# Altium schematic sheet CPU_CONTROL.SchDoc
size A2
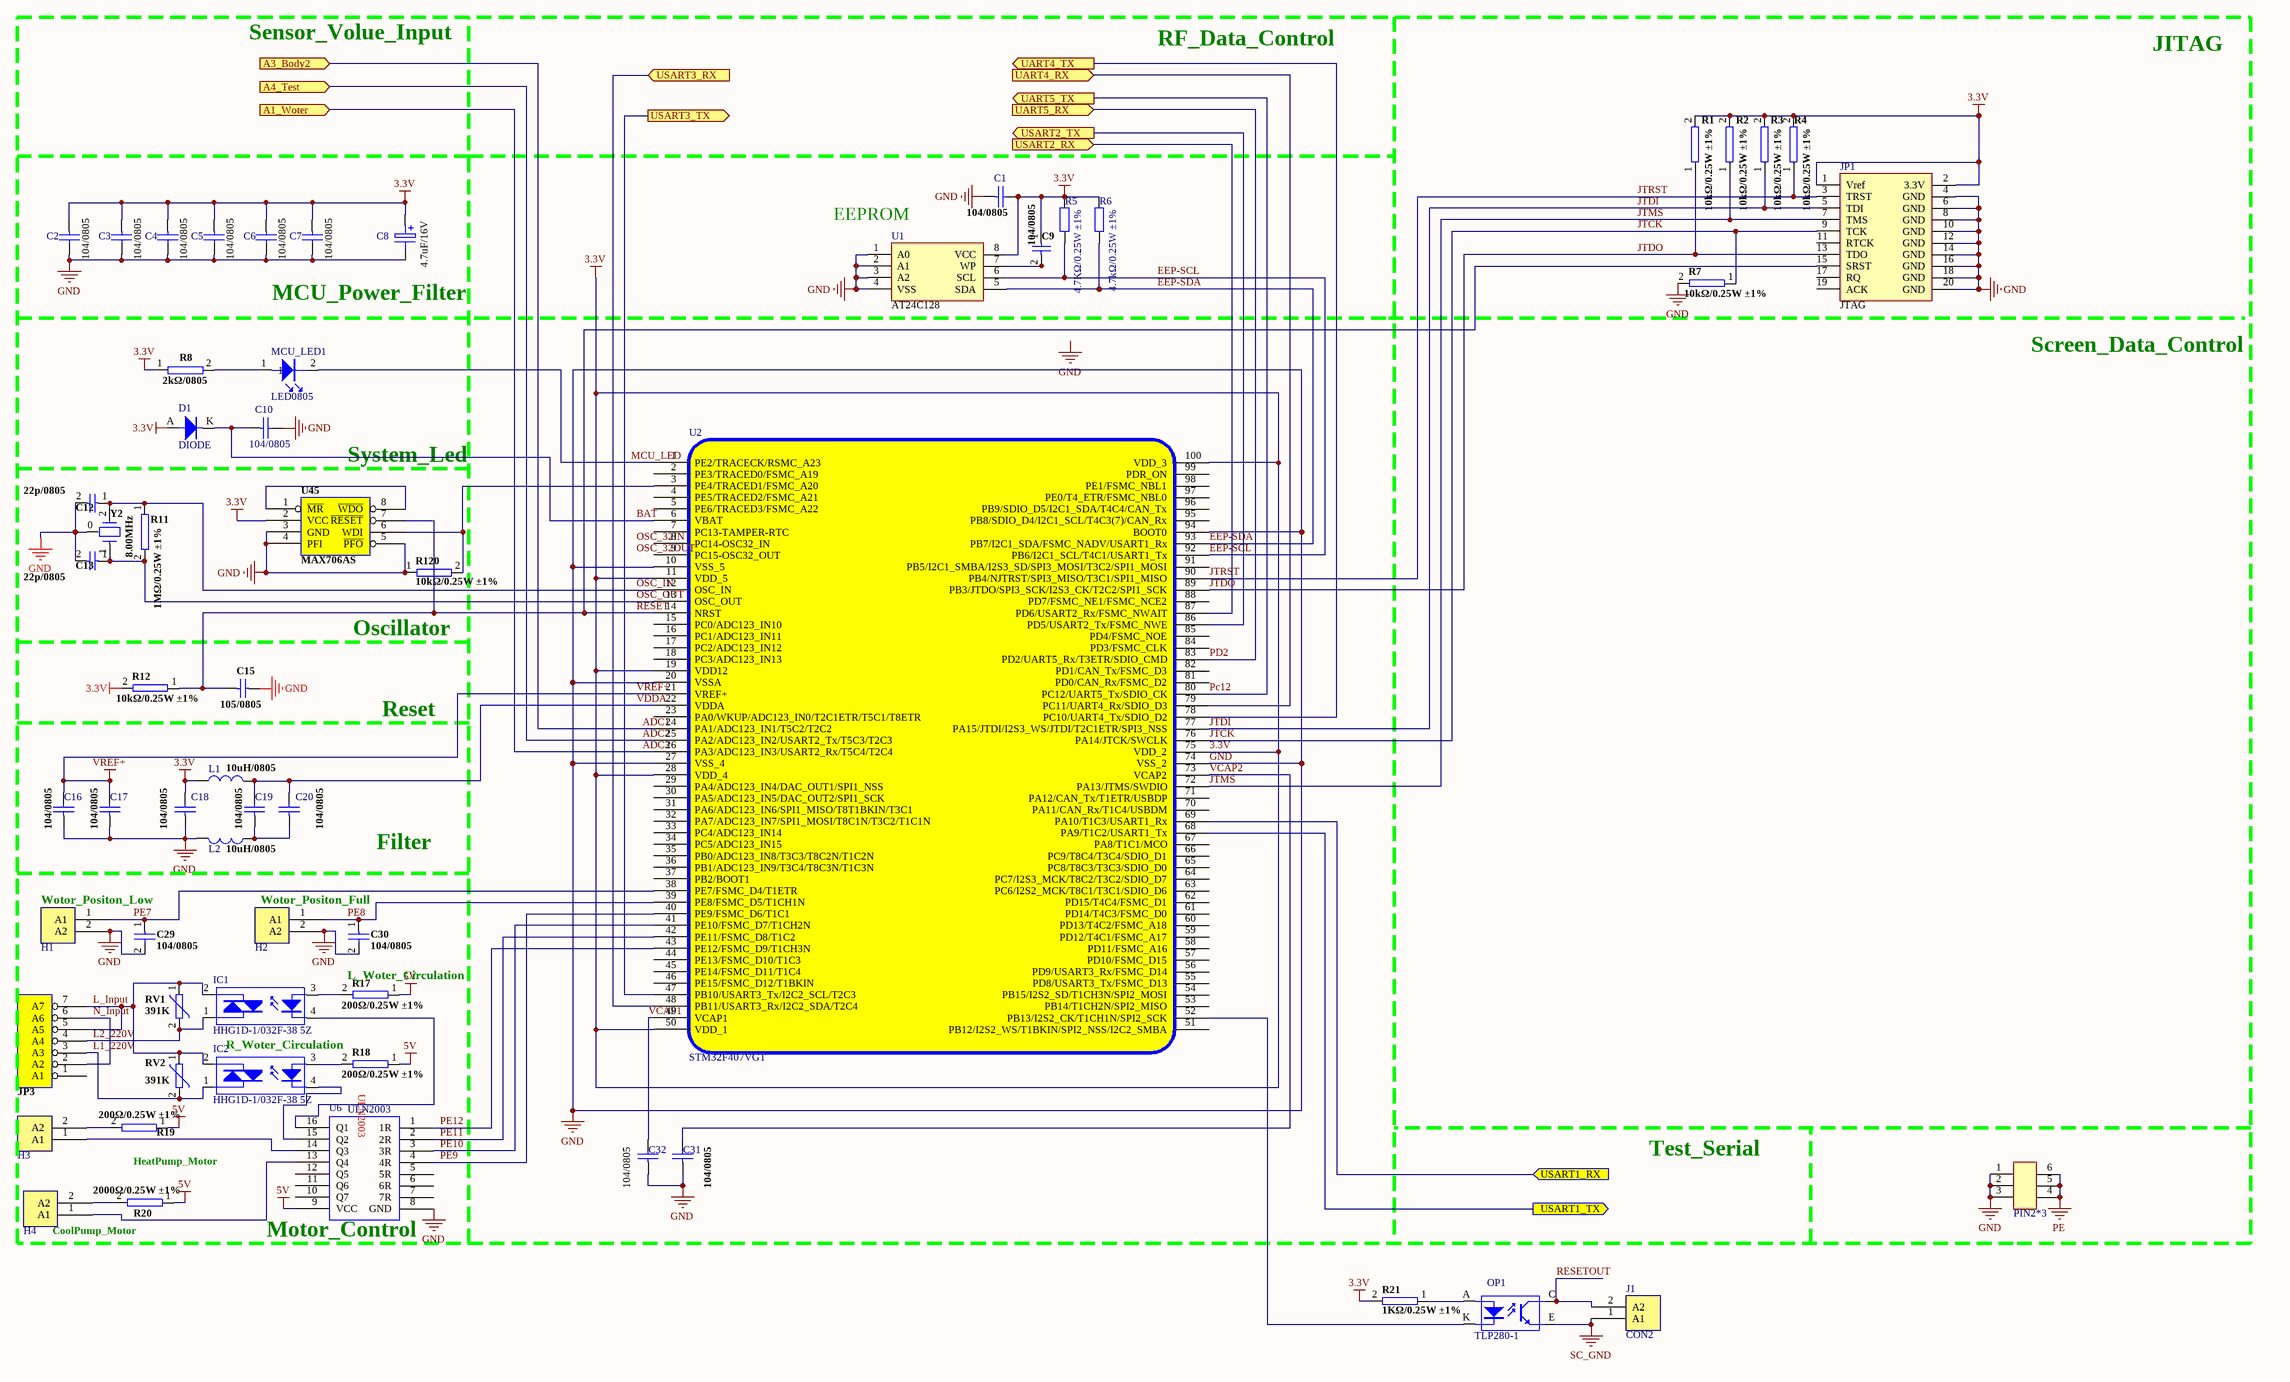
[diagram p0: CPU_CONTROL.SchDoc]

## Parts
C1  104/0805  [C0805]
C2  104/0805  [C0805]
C3  104/0805  [C0805]
C4  104/0805  [C0805]
C5  104/0805  [C0805]
C6  104/0805  [C0805]
C7  104/0805  [C0805]
C8  4.7uF/16V  [CAP5X5]
C9  104/0805  [C0805]
C10  104/0805  [C0805]
C12  22p/0805  [C0805]
C13  22p/0805  [C0805]
C15  105/0805  [C0805]
C16  104/0805  [C0805]
C17  104/0805  [C0805]
C18  104/0805  [C0805]
C19  104/0805  [C0805]
C20  104/0805  [C0805]
C29  104/0805  [C0805]
C30  104/0805  [C0805]
C31  104/0805  [C0805]
C32  104/0805  [C0805]
D1  DIODE  [SOD123]
H1  L_Wotor_Port  [XH2]  (value not drawn)
H2  F_Wotor_Port  [XH2]  (value not drawn)
H3  Heat_Port  [XH2]  (value not drawn)
H4  Cool_Port  [XH2]  (value not drawn)
IC1  HHG1D-1/032F-38 5Z  [HHG1-REALY]
IC2  HHG1D-1/032F-38 5Z  [HHG1-REALY]
J1  CON2  [2Pin-2.54]
JP1  JTAG  [IDC20_A]
JP3  L_N_Port  [HEADER1x7]  (value not drawn)
L1  10uH/0805  [L0805]
L2  10uH/0805  [L0805]
MCU_LED1  LED0805  [LED_0805]
OP1  TLP280-1  [SOP4]
PE1  PIN2*3  [IDC2x3]
R1  10kΩ/0.25W ±1%  [R0805]
R2  10kΩ/0.25W ±1%  [R0805]
R3  10kΩ/0.25W ±1%  [R0805]
R4  10kΩ/0.25W ±1%  [R0805]
R5  4.7KΩ/0.25W ±1%  [R0805]
R6  4.7kΩ/0.25W ±1%  [R0805]
R7  10kΩ/0.25W ±1%  [R0805]
R8  2kΩ/0805  [R0805]
R11  1MΩ/0.25W ±1%  [R0805]
R12  10kΩ/0.25W ±1%  [R0805]
R17  200Ω/0.25W ±1%  [R0805]
R18  200Ω/0.25W ±1%  [R0805]
R19  200Ω/0.25W ±1%  [R0805]
R20  2000Ω/0.25W ±1%  [R0805]
R21  1KΩ/0.25W ±1%  [R0805]
R120  10kΩ/0.25W ±1%  [R0805]
RV1  391K  [RV0.3]
RV2  391K  [RV0.3]
U1  AT24C128  [SO-8]
U2  STM32F407VGT  [LQFP-100]
U6  ULN2003  [SOIC-16]
U45  MAX706AS  [SO-8]
Y2  8.00MHz  [XTAL_SOCKET]

## Ports
A1_Woter (in), A3_Body2 (in), A4_Test (in), UART4_RX (in), UART4_TX (out), UART5_RX (in), UART5_TX (out), USART1_RX (in), USART1_TX (out), USART2_RX (in), USART2_TX (out), USART3_RX (in), USART3_TX (out)

## Nets
3.3V: C1.2 C2.1 C3.1 C4.1 C5.1 C6.1 C7.1 C8.1 C9.1 C18.2 D1.A JP1.1(Vref) JP1.2(3.3V) L1.1 R1.2 R2.2 R3.2 R4.2 R5.2 R6.2 R8.1 R12.2 R21.2 U1.8(VCC) U2.11(VDD_5) U2.19(VDD12) U2.28(VDD_4) U2.50(VDD_1) U2.75(VDD_2) U2.100(VDD_3) U45.2(VCC)
5V: R17.1 R18.1 R19.1 R20.1 U6.9(VCC)
GND: C1.1 C2.2 C3.2 C4.2 C5.2 C6.2 C7.2 C8.2 C10.2 C12.2 C13.2 C15.1 C16.1 C17.1 C18.1 C29.2 C30.2 C31.1 C32.1 H1.2(A2) H2.2(A2) JP1.4(GND) JP1.6(GND) JP1.8(GND) JP1.10(GND) JP1.12(GND) JP1.14(GND) JP1.16(GND) JP1.18(GND) JP1.20(GND) L2.1 PE1.1 PE1.2 PE1.3 R7.2 R120.1 U1.1(A0) U1.2(A1) U1.3(A2) U1.4(VSS) U2.10(VSS_5) U2.20(VSSA) U2.27(VSS_4) U2.74(VSS_2) U2.94(BOOT0) U6.8(GND) U45.3(GND) U45.4(PFI) U45.5(~{PFO}) Y2.0
PE: PE1.4 PE1.5 PE1.6
SC_GND: J1.1(A1) OP1.E
VREF+: C16.2 C17.2 U2.21(VREF+)
ADC1: U2.24(PA1/ADC123_IN1/T5C2/T2C2) ; port A3_Body2
ADC2: U2.25(PA2/ADC123_IN2/USART2_Tx/T5C3/T2C3) ; port A4_Test
ADC3: U2.26(PA3/ADC123_IN3/USART2_Rx/T5C4/T2C4) ; port A1_Woter
BAT: C10.1 D1.K U2.6(VBAT)
EEP-SCL: R5.1 U1.6(SCL) U2.92(PB6/I2C1_SCL/T4C1/USART1_Tx)
EEP-SDA: R6.1 U1.5(SDA) U2.93(PB7/I2C1_SDA/FSMC_NADV/USART1_Rx)
JTCK: JP1.9(TCK) R7.1 U2.76(PA14/JTCK/SWCLK)
JTDI: JP1.5(TDI) R3.1 U2.77(PA15/JTDI/I2S3_WS/JTDI/T2C1ETR/SPI3_NSS)
JTDO: JP1.13(TDO) R1.1 U2.89(PB3/JTDO/SPI3_SCK/I2S3_CK/T2C2/SPI1_SCK)
JTMS: JP1.7(TMS) R2.1 U2.72(PA13/JTMS/SWDIO)
JTRST: JP1.3(TRST) R4.1 U2.90(PB4/NJTRST/SPI3_MISO/T3C1/SPI1_MISO)
L1_220V: IC2.1 JP3.3(A3) RV2.2
L2_220V: IC1.1 JP3.4(A4) RV1.2
L_Input: IC1.2 IC2.2 JP3.5(A5) JP3.7(A7) RV1.1 RV2.1
MCU_LED: MCU_LED1.2 U2.1(PE2/TRACECK/RSMC_A23)
N_Input: JP3.2(A2) JP3.6(A6)
OSC_IN: C12.1 R11.1 U2.12(OSC_IN) Y2.2
OSC_OUT: C13.1 R11.2 U2.13(OSC_OUT) Y2.1
Pc12: U2.80(PC12/UART5_Tx/SDIO_CK) ; port UART5_TX
PD2: U2.83(PD2/UART5_Rx/T3ETR/SDIO_CMD) ; port UART5_RX
PE7: C29.1 H1.1(A1) U2.38(PE7/FSMC_D4/T1ETR)
PE8: C30.1 H2.1(A1) U2.39(PE8/FSMC_D5/T1CH1N)
PE9: U2.40(PE9/FSMC_D6/T1C1) U6.4(4R)
PE10: U2.41(PE10/FSMC_D7/T1CH2N) U6.3(3R)
PE11: U2.42(PE11/FSMC_D8/T1C2) U6.2(2R)
PE12: U2.43(PE12/FSMC_D9/T1CH3N) U6.1(1R)
RESET: C15.2 JP1.15(SRST) R12.1 U2.14(NRST) U45.7(~{RESET})
RESETOUT: J1.2(A2) OP1.C
UART4_RX: U2.79(PC11/UART4_Rx/SDIO_D3) ; port UART4_RX
UART4_TX: U2.78(PC10/UART4_Tx/SDIO_D2) ; port UART4_TX
USART1_RX: U2.69(PA10/T1C3/USART1_Rx) ; port USART1_RX
USART1_TX: U2.68(PA9/T1C2/USART1_Tx) ; port USART1_TX
USART2_RX: U2.87(PD6/USART2_Rx/FSMC_NWAIT) ; port USART2_RX
USART2_TX: U2.86(PD5/USART2_Tx/FSMC_NWE) ; port USART2_TX
USART3_RX: U2.48(PB11/USART3_Rx/I2C2_SDA/T2C4) ; port USART3_RX
USART3_TX: U2.47(PB10/USART3_Tx/I2C2_SCL/T2C3) ; port USART3_TX
VCAP1: C32.2 U2.49(VCAP1)
VCAP2: C31.2 U2.73(VCAP2)
VDDA: C19.2 C20.2 L1.2 U2.22(VDDA)
NetC9_2: C9.2 U1.7(WP)
NetC19_1: C19.1 C20.1 L2.2
NetH3_1: H3.1(A1) U6.14(Q3)
NetH3_2: H3.2(A2) R19.2
NetH4_1: H4.1(A1) U6.13(Q4)
NetH4_2: H4.2(A2) R20.2
NetIC1_3: IC1.3 R17.2
NetIC1_4: IC1.4 U6.16(Q1)
NetIC2_3: IC2.3 R18.2
NetIC2_4: IC2.4 U6.15(Q2)
NetMCU_LED1_1: MCU_LED1.1 R8.2
NetOP1_A: OP1.A R21.1
NetOP1_K: OP1.K U2.52(PB13/I2S2_CK/T1CH1N/SPI2_SCK)
NetR120_2: R120.2 U2.3(PE4/TRACED1/FSMC_A20) U45.6(WDI)
NetU45_1: U45.1(~{MR}) U45.8(~{WDO})

Not connected (* = marked no-connect by the designer): JP1 11(RTCK) 17(RQ) 19(ACK); JP3 1(A1); U2 2(PE3/TRACED0/FSMC_A19) 4(PE5/TRACED2/FSMC_A21) 5(PE6/TRACED3/FSMC_A22) 7(PC13-TAMPER-RTC) 8(PC14-OSC32_IN) 9(PC15-OSC32_OUT) 15(PC0/ADC123_IN10) 16(PC1/ADC123_IN11) 17(PC2/ADC123_IN12) 18(PC3/ADC123_IN13) 23(PA0/WKUP/ADC123_IN0/T2C1ETR/T5C1/T8ETR) 29(PA4/ADC123_IN4/DAC_OUT1/SPI1_NSS) 30(PA5/ADC123_IN5/DAC_OUT2/SPI1_SCK) 31(PA6/ADC123_IN6/SPI1_MISO/T8T1BKIN/T3C1) 32(PA7/ADC123_IN7/SPI1_MOSI/T8C1N/T3C2/T1C1N) 33(PC4/ADC123_IN14) 34(PC5/ADC123_IN15) 35(PB0/ADC123_IN8/T3C3/T8C2N/T1C2N) 36(PB1/ADC123_IN9/T3C4/T8C3N/T1C3N) 37(PB2/BOOT1) 44(PE13/FSMC_D10/T1C3) 45(PE14/FSMC_D11/T1C4) 46(PE15/FSMC_D12/T1BKIN) 51(PB12/I2S2_WS/T1BKIN/SPI2_NSS/I2C2_SMBA) 53(PB14/T1CH2N/SPI2_MISO) 54(PB15/I2S2_SD/T1CH3N/SPI2_MOSI) 55(PD8/USART3_Tx/FSMC_D13) 56(PD9/USART3_Rx/FSMC_D14) 57(PD10/FSMC_D15) 58(PD11/FSMC_A16) 59(PD12/T4C1/FSMC_A17) 60(PD13/T4C2/FSMC_A18) 61(PD14/T4C3/FSMC_D0) 62(PD15/T4C4/FSMC_D1) 63(PC6/I2S2_MCK/T8C1/T3C1/SDIO_D6) 64(PC7/I2S3_MCK/T8C2/T3C2/SDIO_D7) 65(PC8/T8C3/T3C3/SDIO_D0) 66(PC9/T8C4/T3C4/SDIO_D1) 67(PA8/T1C1/MCO) 70(PA11/CAN_Rx/T1C4/USBDM) 71(PA12/CAN_Tx/T1ETR/USBDP) 81(PD0/CAN_Rx/FSMC_D2) 82(PD1/CAN_Tx/FSMC_D3) 84(PD3/FSMC_CLK) 85(PD4/FSMC_NOE) 88(PD7/FSMC_NE1/FSMC_NCE2) 91(PB5/I2C1_SMBA/I2S3_SD/SPI3_MOSI/T3C2/SPI1_MOSI) 95(PB8/SDIO_D4/I2C1_SCL/T4C3(7)/CAN_Rx) 96(PB9/SDIO_D5/I2C1_SDA/T4C4/CAN_Tx) 97(PE0/T4_ETR/FSMC_NBL0) 98(PE1/FSMC_NBL1) 99(PDR_ON); U6 5(5R) 6(6R) 7(7R) 10(Q7) 11(Q6) 12(Q5)

## Notes on the sheet
- Sensor_Volue_Input
- RF_Data_Control
- JITAG
- (near U1) EEPROM
- MCU_Power_Filter
- Screen_Data_Control
- (near U45) System_Led
- (near R120) Oscillator
- Reset
- Filter
- (near H1) Wotor_Positon_Low
- (near H2) Wotor_Positon_Full
- L_Woter_Circulation
- R_Woter_Circulation
- HeatPump_Motor
- Test_Serial
- (near H4) CoolPump_Motor
- (near U6) Motor_Control
- Labels drawn without touching a wire or pin: GND, OSC_32IN, OSC_32OUT

## Library data of the parts
C1-C7 C16-C20 C29-C32 = CAP: 贴片电容 104/25V ±1% C0805
C8 = ELECTRO1: 贴片钽电容 4.7uF/16V ±10% CAP5X5
C9 = CAP: 贴片电容 104/25V ±1% C0805; Part Field 1: 08-500106-06
C10 = CAP: 贴片电容 104/50V ±1% C0805
C12 C13 = CAP: 贴片电容 22pF/25V ±1% C0805
C15 = CAP: 贴片电容 105/25V ±1% C0805; Value: 100pF; Published: 8-Jun-2000; Revision: July-2002: Re-released for DXP Platform.; Publisher: Altium Limited
D1 = DIODE: 高速开关二极管 IN4148 1V 150mA SOD123
H1-H4 = CON2: 插座式端子 XH2.54-2P 250V(DC/AC) 3A
IC1 IC2 = OPTOTRIAC: 固态继电器 HHG1D-1/032F-38 5Z HHG1-REALY
J1 = CON2: 单排排针（2针）2.54mm 2Pin-2.54
JP1 = JTAG20: 双排排针（10针）2.54mm IDC20_A
JP3 = CON7: 接线端子 22-12AWG 300V 20A 间距8.5mm/HEADER1x7
L1 L2 = INDUCTOR1: 贴片电感 10uH/L0805/0.25W ±10%
MCU_LED1 = LED0805: 贴片LED灯 2.0V 20mA 蓝色 LED_0805
OP1 = TLP521: 光耦 TLP280-1 SOP4
PE1 = PIN2*3: 双排排针（3针）2.54mm IDC2x3
R1-R4 R7 R12 R120 = RES2: 贴片电阻 10kΩ 0.25W ±1% R0805
R5 = Res2: 贴片电阻 4.7kΩ 0.25W ±1% R0805; Value: 4.7K/0805; Published: 8-Jun-2000; LatestRevisionDate: 17-Jul-2002; LatestRevisionNote: Re-released for DXP Platform.; PackageReference: AXIAL-0.4; Publisher: Altium Limited
R6 = Res2: 贴片电阻 4.7kΩ/0.25W ±1% R0805; Value: 4.7ΩK/0.25W; Published: 8-Jun-2000; LatestRevisionDate: 17-Jul-2002; LatestRevisionNote: Re-released for DXP Platform.; PackageReference: AXIAL-0.4; Publisher: Altium Limited
R8 = RES2: 贴片电阻 2kΩ 0.25W ±1% R0805; Part Field 1: 06-115611-18
R11 = RES2: 贴片电阻 1MΩ 0.25W ±1% R0805
R17-R19 = RES2: 贴片电阻 200Ω 0.25W ±1% R0805
R20 = RES2: 贴片电阻 2kΩ 0.25W ±1% R0805
R21 = RES2: 贴片电阻 1kΩ 0.25W ±1% R0805
RV1 RV2 = VARISTOR: 压敏电阻 391K 340V ±10% RV0.3
U1 = 24WC02: 存储器 EEPROM 芯片 AT24C128 SO-8
U2 = STM32F407VGT: STM32F407单片机 STM32F407VGT LQFP-100
U6 = ULN2003: 达林顿三极管集成IC ULN2003 SOIC-16
U45 = MAX705CPA: 看门狗IC MAX706AS SO-8
Y2 = CRYSTAL: 晶振 8.00MHz XTAL_SOCKET; 物?: *; 部?: *; 供?: *